# Altium schematic sheet МПСУ-46342.21-004 Э3 Лист2.SchDoc
size 297 x 209 mm; Address1: Address1; Address2: Address2; Address3: Address3; Address4: Address4; SheetNumber: 2; Scale: 1:1; Обозначение документа: МПСУ-46342.21-004 Э3
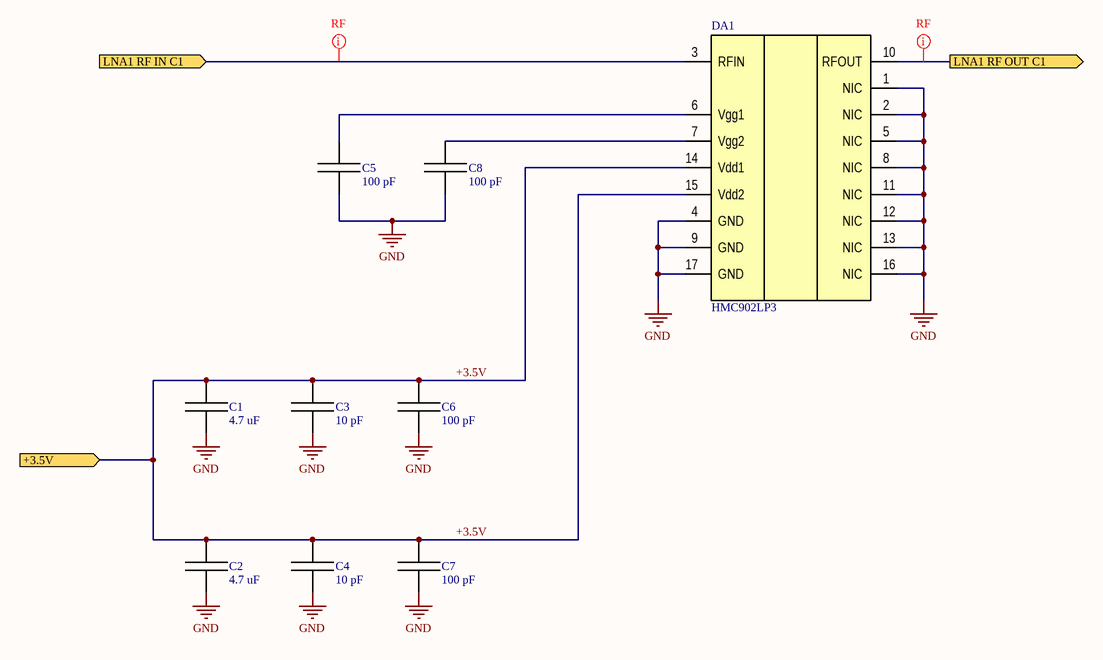
[diagram p0: МПСУ-46342.21-004 Э3 Лист2.SchDoc]

## Parts
C1  4.7 uF  [CAPC160X80X90L30N]
C2  4.7 uF  [CAPC160X80X90L30N]
C3  10 pF  [CAPC100X50X55L20N]
C4  10 pF  [CAPC100X50X55L20N]
C5  100 pF  [CAPC100X50X55L20N]
C6  100 pF  [CAPC100X50X55L20N]
C7  100 pF  [CAPC100X50X55L20N]
C8  100 pF  [CAPC100X50X55L20N]
DA1  HMC902LP3  [QFN17P50_300X300X90L40X25T170N]

## Ports
+3.5V (in), LNA1 RF IN C1 (in), LNA1 RF OUT C1 (out)

## Nets
GND: C1.1 C2.1 C3.1 C4.1 C5.1 C6.1 C7.1 C8.1 DA1.1(NIC) DA1.2(NIC) DA1.4(GND) DA1.5(NIC) DA1.8(NIC) DA1.9(GND) DA1.11(NIC) DA1.12(NIC) DA1.13(NIC) DA1.16(NIC) DA1.17(GND)
+3.5V: C1.2 C2.2 C3.2 C4.2 C6.2 C7.2 DA1.14(Vdd1) DA1.15(Vdd2) ; port +3.5V
LNA1 RF IN C1: DA1.3(RFIN) ; port LNA1 RF IN C1
LNA1 RF OUT C1: DA1.10(RFOUT) ; port LNA1 RF OUT C1
NetC5_2: C5.2 DA1.6(Vgg1)
NetC8_2: C8.2 DA1.7(Vgg2)

## Layout directives
net class RF: LNA1 RF IN C1, LNA1 RF OUT C1

## Notes on the sheet
- Подп. и дата
- Инв. № дубл.
- Взам. инв. №
- Инв. № подл.
- Изм.
- Лист
- № докум.
- Подп.
- Дата
- Копировал
- Формат А4

## Library data of the parts
C1 C2 C5-C8 = Capacitor: Capacitor, generic; Tolerance: 5 %; VDC: 20 V; PartNumber: *; Dielectric: *; Manufacturer: *
  C1: Value: 4.7 uF; Package: 0603
  C2: Value: 4.7 uF; Package: 0402
  C5-C8: Value: 100 pF; Package: 0402
C3 C4 = Capacitor: Capacitor, generic; Value: 0.01 nF; Tolerance: 5 %; VDC: 20 V; PartNumber: *; Dielectric: *; Manufacturer: *; Package: 0402
DA1 = HMC902LP3: GaAs, pHEMT, MMIC, Low Noise Amplifier, 5 GHz to 11 GHz; Manufacturer: Analog Devices; ComponentLink1Description: Component page; ComponentLink1URL: https://www.analog.com/en/products/hmc902lp3e.html; PartNumber: HMC902LP3; ClassName: RFCons